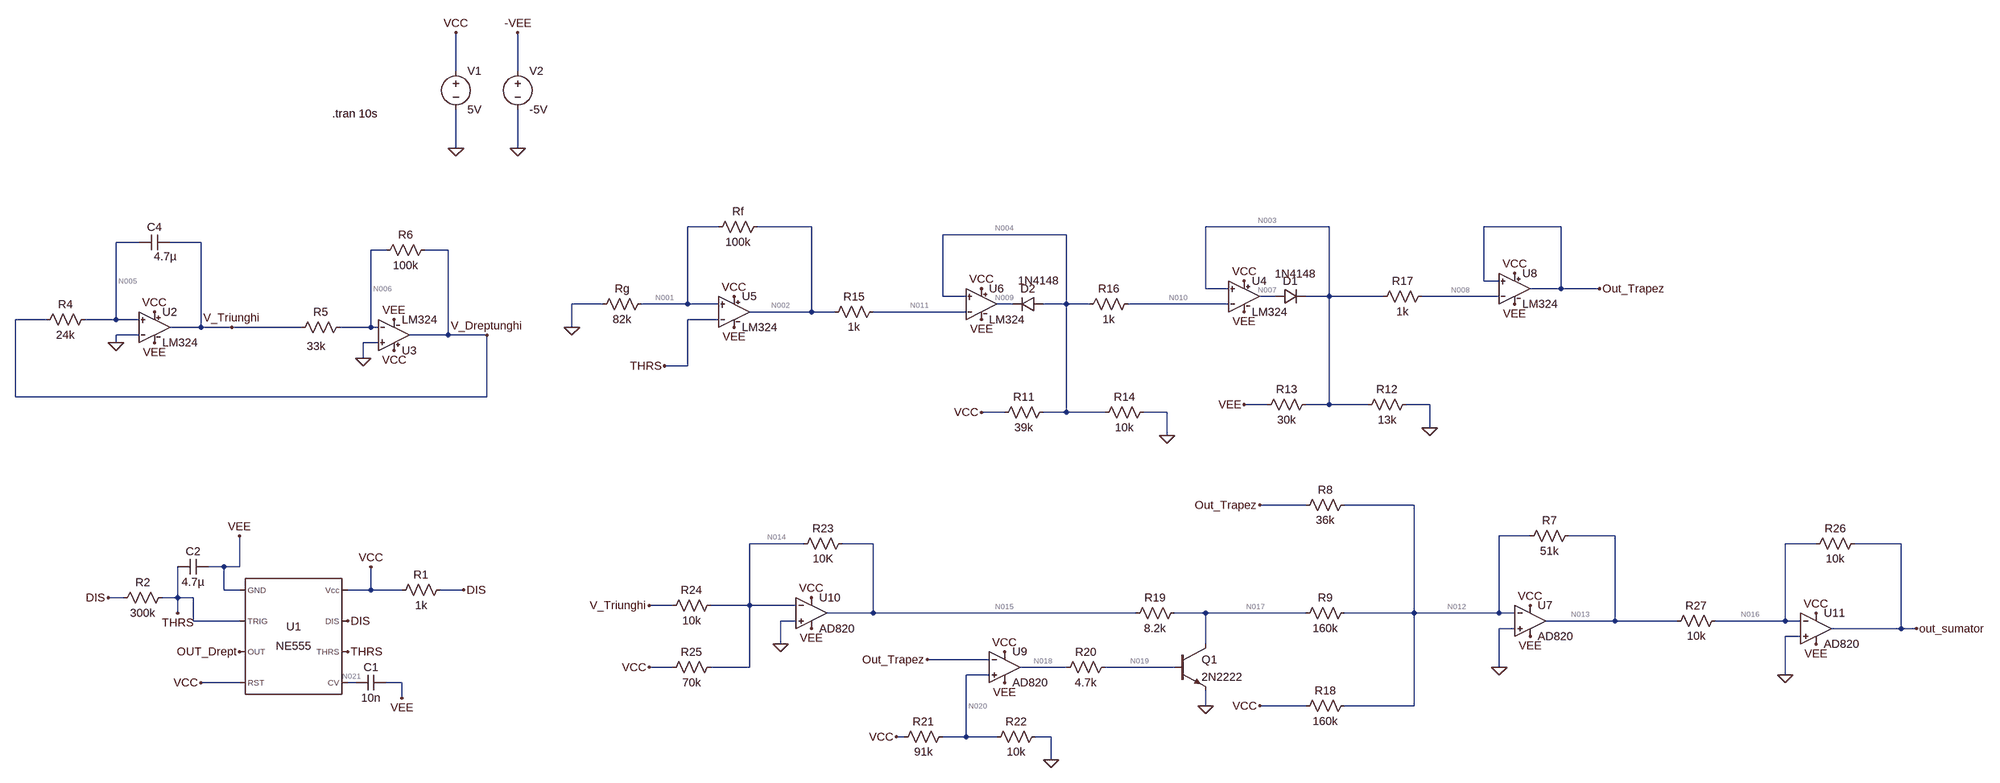
[diagram p0: schematic SCIAPROIECT.asc]
SCIAPROIECT.asc, the LTspice schematic file:
Version 4.1
SHEET 1 1268 1000
WIRE -2016 -960 -2016 -1040
WIRE -1888 -960 -1888 -1040
WIRE -2016 -800 -2016 -880
WIRE -1888 -800 -1888 -880
WIRE -1472 -624 -1536 -624
WIRE -1280 -624 -1392 -624
WIRE -208 -624 -464 -624
WIRE 272 -624 112 -624
WIRE -752 -608 -1008 -608
WIRE -2672 -592 -2720 -592
WIRE -2544 -592 -2608 -592
WIRE -2160 -576 -2192 -576
WIRE -2032 -576 -2080 -576
WIRE 112 -512 112 -624
WIRE 144 -512 112 -512
WIRE -464 -496 -464 -624
WIRE -416 -496 -464 -496
WIRE 272 -496 272 -624
WIRE 272 -496 208 -496
WIRE 352 -496 272 -496
WIRE -1008 -480 -1008 -608
WIRE -960 -480 -1008 -480
WIRE -320 -480 -352 -480
WIRE -208 -480 -208 -624
WIRE -208 -480 -256 -480
WIRE -96 -480 -208 -480
WIRE 144 -480 -16 -480
WIRE -1712 -464 -1776 -464
WIRE -1536 -464 -1536 -624
WIRE -1536 -464 -1632 -464
WIRE -1472 -464 -1536 -464
WIRE -864 -464 -896 -464
WIRE -752 -464 -752 -608
WIRE -752 -464 -800 -464
WIRE -704 -464 -752 -464
WIRE -416 -464 -624 -464
WIRE -1280 -448 -1280 -624
WIRE -1280 -448 -1408 -448
WIRE -1232 -448 -1280 -448
WIRE -960 -448 -1152 -448
WIRE -2864 -432 -2928 -432
WIRE -2720 -432 -2720 -592
WIRE -2720 -432 -2784 -432
WIRE -2672 -432 -2720 -432
WIRE -1472 -432 -1536 -432
WIRE -2544 -416 -2544 -592
WIRE -2544 -416 -2608 -416
WIRE -2480 -416 -2544 -416
WIRE -2336 -416 -2480 -416
WIRE -2192 -416 -2192 -576
WIRE -2192 -416 -2256 -416
WIRE -2176 -416 -2192 -416
WIRE -1776 -416 -1776 -464
WIRE -2672 -400 -2720 -400
WIRE -2032 -400 -2032 -576
WIRE -2032 -400 -2112 -400
WIRE -1952 -400 -2032 -400
WIRE -2720 -384 -2720 -400
WIRE -2176 -384 -2208 -384
WIRE -2208 -352 -2208 -384
WIRE -1536 -336 -1536 -432
WIRE -1536 -336 -1584 -336
WIRE -2928 -272 -2928 -432
WIRE -1952 -272 -1952 -400
WIRE -1952 -272 -2928 -272
WIRE -336 -256 -384 -256
WIRE -208 -256 -208 -480
WIRE -208 -256 -256 -256
WIRE -128 -256 -208 -256
WIRE 0 -256 -48 -256
WIRE -880 -240 -928 -240
WIRE -752 -240 -752 -464
WIRE -752 -240 -800 -240
WIRE -672 -240 -752 -240
WIRE -544 -240 -592 -240
WIRE 0 -208 0 -256
WIRE -544 -192 -544 -240
WIRE -256 -48 -352 -48
WIRE -32 -48 -176 -48
WIRE 208 16 144 16
WIRE 384 16 288 16
WIRE -1296 32 -1408 32
WIRE -1152 32 -1216 32
WIRE 800 32 736 32
WIRE 976 32 880 32
WIRE -2496 80 -2528 80
WIRE -2464 80 -2464 16
WIRE -2464 80 -2496 80
WIRE -2496 128 -2496 80
WIRE -2464 128 -2496 128
WIRE -2192 128 -2192 80
WIRE -2192 128 -2240 128
WIRE -2128 128 -2192 128
WIRE -2000 128 -2048 128
WIRE -2704 144 -2736 144
WIRE -2592 144 -2592 80
WIRE -2592 144 -2624 144
WIRE -2560 144 -2592 144
WIRE -1568 160 -1616 160
WIRE -1408 160 -1408 32
WIRE -1408 160 -1488 160
WIRE -1312 160 -1408 160
WIRE -2592 176 -2592 144
WIRE -1152 176 -1152 32
WIRE -1152 176 -1248 176
WIRE -608 176 -1152 176
WIRE -464 176 -528 176
WIRE -256 176 -464 176
WIRE -32 176 -32 -48
WIRE -32 176 -176 176
WIRE 144 176 144 16
WIRE 144 176 -32 176
WIRE 176 176 144 176
WIRE -2560 192 -2560 144
WIRE -2464 192 -2560 192
WIRE -1312 192 -1344 192
WIRE 384 192 384 16
WIRE 384 192 240 192
WIRE 512 192 384 192
WIRE 736 192 736 32
WIRE 736 192 592 192
WIRE 768 192 736 192
WIRE 176 208 144 208
WIRE 976 208 976 32
WIRE 976 208 832 208
WIRE 1008 208 976 208
WIRE 768 224 736 224
WIRE -1344 240 -1344 192
WIRE -464 240 -464 176
WIRE -912 272 -1040 272
WIRE -1568 288 -1616 288
WIRE -1408 288 -1408 160
WIRE -1408 288 -1488 288
WIRE -752 288 -848 288
WIRE -528 288 -672 288
WIRE 144 288 144 208
WIRE -912 304 -960 304
WIRE 736 304 736 224
WIRE -2464 320 -2544 320
WIRE -2224 320 -2240 320
WIRE -2128 320 -2160 320
WIRE -2128 352 -2128 320
WIRE -464 368 -464 336
WIRE -256 368 -352 368
WIRE -32 368 -32 176
WIRE -32 368 -176 368
WIRE -1088 432 -1104 432
WIRE -960 432 -960 304
WIRE -960 432 -1008 432
WIRE -896 432 -960 432
WIRE -784 432 -816 432
WIRE -784 480 -784 432
FLAG -2192 80 VCC
FLAG -2544 320 VCC
FLAG -2000 128 DIS
FLAG -2240 192 DIS
FLAG -2736 144 DIS
FLAG -2240 256 THRS
FLAG -2592 176 THRS
FLAG -2464 256 OUT_Drept
FLAG -2640 -448 VCC
FLAG -2640 -384 VEE
FLAG -2144 -368 VCC
FLAG -2720 -384 0
FLAG -2480 -416 V_Triunghi
FLAG -1952 -400 V_Dreptunghi
FLAG -2208 -352 0
FLAG -2144 -432 VEE
FLAG -1440 -480 VCC
FLAG -1440 -416 VEE
FLAG -1584 -336 THRS
FLAG -1776 -416 0
FLAG -544 -192 0
FLAG -928 -240 VCC
FLAG -928 -496 VCC
FLAG -928 -432 VEE
FLAG -2464 16 VEE
FLAG 352 -496 Out_Trapez
FLAG 0 -208 0
FLAG -384 -512 VCC
FLAG -384 -448 VEE
FLAG -384 -256 VEE
FLAG 176 -528 VCC
FLAG 176 -464 VEE
FLAG 144 288 0
FLAG 208 224 VEE
FLAG 1008 208 out_sumator
FLAG -2128 352 VEE
FLAG -464 368 0
FLAG -1040 272 Out_Trapez
FLAG -784 480 0
FLAG -880 256 VCC
FLAG -880 320 VEE
FLAG -1104 432 VCC
FLAG -1616 160 V_Triunghi
FLAG -1280 144 VCC
FLAG -1280 208 VEE
FLAG -1344 240 0
FLAG 736 304 0
FLAG 800 176 VCC
FLAG 800 240 VEE
FLAG -1616 288 VCC
FLAG 208 160 VCC
FLAG -352 368 VCC
FLAG -352 -48 Out_Trapez
FLAG -2016 -800 0
FLAG -1888 -800 0
FLAG -2016 -1040 VCC
FLAG -1888 -1040 -VEE
SYMBOL Misc\\NE555 -2352 224 R0
SYMATTR InstName U1
SYMBOL cap -2160 304 R90
WINDOW 0 0 32 VBottom 2
WINDOW 3 32 32 VTop 2
SYMATTR InstName C1
SYMATTR Value 10n
SYMBOL res -2032 112 R90
WINDOW 0 0 56 VBottom 2
WINDOW 3 32 56 VTop 2
SYMATTR InstName R1
SYMATTR Value 1k
SYMBOL res -2608 128 R90
WINDOW 0 0 56 VBottom 2
WINDOW 3 32 56 VTop 2
SYMATTR InstName R2
SYMATTR Value 300k
SYMBOL cap -2528 64 R90
WINDOW 0 0 32 VBottom 2
WINDOW 3 32 32 VTop 2
SYMATTR InstName C2
SYMATTR Value 4.7µ
SYMBOL cap -2608 -608 R90
WINDOW 0 0 32 VBottom 2
WINDOW 3 30 10 VTop 2
SYMATTR InstName C4
SYMATTR Value 4.7µ
SYMBOL res -2768 -448 R90
WINDOW 0 0 56 VBottom 2
WINDOW 3 32 56 VTop 2
SYMATTR InstName R4
SYMATTR Value 24k
SYMBOL res -2240 -432 R90
WINDOW 0 0 56 VBottom 2
WINDOW 3 40 65 VTop 2
SYMATTR InstName R5
SYMATTR Value 33k
SYMBOL res -2064 -592 R90
WINDOW 0 0 56 VBottom 2
WINDOW 3 32 56 VTop 2
SYMATTR InstName R6
SYMATTR Value 100k
SYMBOL res -1616 -480 R90
WINDOW 0 0 56 VBottom 2
WINDOW 3 32 56 VTop 2
SYMATTR InstName Rg
SYMATTR Value 82k
SYMBOL res -1376 -640 R90
WINDOW 0 0 56 VBottom 2
WINDOW 3 32 56 VTop 2
SYMATTR InstName Rf
SYMATTR Value 100k
SYMBOL res -576 -256 R90
WINDOW 0 0 56 VBottom 2
WINDOW 3 32 56 VTop 2
SYMATTR InstName R14
SYMATTR Value 10k
SYMBOL res -1136 -464 R90
WINDOW 0 0 56 VBottom 2
WINDOW 3 32 56 VTop 2
SYMATTR InstName R15
SYMATTR Value 1k
SYMBOL diode -800 -480 R90
WINDOW 0 0 32 VBottom 2
WINDOW 3 -48 10 VTop 2
SYMATTR InstName D2
SYMATTR Value 1N4148
SYMBOL res -784 -256 R90
WINDOW 0 0 56 VBottom 2
WINDOW 3 32 56 VTop 2
SYMATTR InstName R11
SYMATTR Value 39k
SYMBOL res -32 -272 R90
WINDOW 0 0 56 VBottom 2
WINDOW 3 32 56 VTop 2
SYMATTR InstName R12
SYMATTR Value 13k
SYMBOL diode -320 -464 R270
WINDOW 0 32 32 VTop 2
WINDOW 3 78 42 VBottom 2
SYMATTR InstName D1
SYMATTR Value 1N4148
SYMBOL res -240 -272 R90
WINDOW 0 0 56 VBottom 2
WINDOW 3 32 56 VTop 2
SYMATTR InstName R13
SYMATTR Value 30k
SYMBOL res -608 -480 R90
WINDOW 0 0 56 VBottom 2
WINDOW 3 32 56 VTop 2
SYMATTR InstName R16
SYMATTR Value 1k
SYMBOL res 0 -496 R90
WINDOW 0 0 56 VBottom 2
WINDOW 3 32 56 VTop 2
SYMATTR InstName R17
SYMATTR Value 1k
SYMBOL LM324 -1440 -512 R0
SYMATTR InstName U5
SYMBOL LM324 -928 -528 R0
SYMATTR InstName U6
SYMBOL LM324 -384 -544 R0
SYMATTR InstName U4
SYMBOL LM324 176 -560 R0
SYMATTR InstName U8
SYMBOL res 304 0 R90
WINDOW 0 0 56 VBottom 2
WINDOW 3 32 56 VTop 2
SYMATTR InstName R7
SYMATTR Value 51k
SYMBOL res -160 -64 R90
WINDOW 0 0 56 VBottom 2
WINDOW 3 32 56 VTop 2
SYMATTR InstName R8
SYMATTR Value 36k
SYMBOL res -160 352 R90
WINDOW 0 0 56 VBottom 2
WINDOW 3 32 56 VTop 2
SYMATTR InstName R18
SYMATTR Value 160k
SYMBOL LM324 -2640 -480 R0
SYMATTR InstName U2
SYMBOL LM324 -2144 -336 M180
SYMATTR InstName U3
SYMBOL res -656 272 R90
WINDOW 0 0 56 VBottom 2
WINDOW 3 32 56 VTop 2
SYMATTR InstName R20
SYMATTR Value 4.7k
SYMBOL res -992 416 R90
WINDOW 0 0 56 VBottom 2
WINDOW 3 32 56 VTop 2
SYMATTR InstName R21
SYMATTR Value 91k
SYMBOL res -800 416 R90
WINDOW 0 0 56 VBottom 2
WINDOW 3 32 56 VTop 2
SYMATTR InstName R22
SYMATTR Value 10k
SYMBOL OpAmps\\AD820 208 128 R0
SYMATTR InstName U7
SYMBOL npn -528 240 R0
SYMATTR InstName Q1
SYMATTR Value 2N2222
SYMBOL res -160 160 R90
WINDOW 0 0 56 VBottom 2
WINDOW 3 32 56 VTop 2
SYMATTR InstName R9
SYMATTR Value 160k
SYMBOL res -512 160 R90
WINDOW 0 0 56 VBottom 2
WINDOW 3 32 56 VTop 2
SYMATTR InstName R19
SYMATTR Value 8.2k
SYMBOL OpAmps\\AD820 -1280 112 R0
SYMATTR InstName U10
SYMBOL res -1200 16 R90
WINDOW 0 0 56 VBottom 2
WINDOW 3 32 56 VTop 2
SYMATTR InstName R23
SYMATTR Value 10K
SYMBOL res -1472 144 R90
WINDOW 0 0 56 VBottom 2
WINDOW 3 32 56 VTop 2
SYMATTR InstName R24
SYMATTR Value 10k
SYMBOL res -1472 272 R90
WINDOW 0 0 56 VBottom 2
WINDOW 3 32 56 VTop 2
SYMATTR InstName R25
SYMATTR Value 70k
SYMBOL res 896 16 R90
WINDOW 0 0 56 VBottom 2
WINDOW 3 32 56 VTop 2
SYMATTR InstName R26
SYMATTR Value 10k
SYMBOL OpAmps\\AD820 800 144 R0
SYMATTR InstName U11
SYMBOL res 608 176 R90
WINDOW 0 0 56 VBottom 2
WINDOW 3 32 56 VTop 2
SYMATTR InstName R27
SYMATTR Value 10k
SYMBOL OpAmps\\AD820 -880 224 R0
SYMATTR InstName U9
SYMBOL voltage -2016 -976 R0
SYMATTR InstName V1
SYMATTR Value 5V
SYMBOL voltage -1888 -976 R0
SYMATTR InstName V2
SYMATTR Value -5V
TEXT -2272 -872 Left 2 !.tran 10s

The netlist it stands for:
* SCIAPROIECT.asc
X§U1 VEE THRS OUT_Drept VCC N021 THRS DIS VCC NE555  ; pins GND TRIG OUT RST CV THRS DIS Vcc
C1 VEE N021 10n
R1 DIS VCC 1k
R2 THRS DIS 300k
C2 VEE THRS 4.7µ
C4 V_Triunghi N005 4.7µ
R4 N005 V_Dreptunghi 24k
R5 N006 V_Triunghi 33k
R6 V_Dreptunghi N006 100k
Rg N001 0 82k
Rf N002 N001 100k
R14 0 N004 10k
R15 N011 N002 1k
D2 N004 N009 1N4148
R11 N004 VCC 39k
R12 0 N003 13k
D1 N007 N003 1N4148
R13 N003 VEE 30k
R16 N010 N004 1k
R17 N008 N003 1k
X§U5 THRS N001 VCC VEE N002 LM324  ; pins In+ In- V+ V- OUT
X§U6 N011 N004 VCC VEE N009 LM324  ; pins In+ In- V+ V- OUT
X§U4 N010 N003 VCC VEE N007 LM324  ; pins In+ In- V+ V- OUT
X§U8 N008 Out_Trapez VCC VEE Out_Trapez LM324  ; pins In+ In- V+ V- OUT
R7 N013 N012 51k
R8 N012 Out_Trapez 36k
R18 N012 VCC 160k
X§U2 0 N005 VCC VEE V_Triunghi LM324  ; pins In+ In- V+ V- OUT
X§U3 N006 0 VCC VEE V_Dreptunghi LM324  ; pins In+ In- V+ V- OUT
R20 N019 N018 4.7k
R21 N020 VCC 91k
R22 0 N020 10k
X§U7 0 N012 VCC VEE N013 AD820  ; pins In+ In- V+ V- OUT
Q1 N017 N019 0 0 2N2222
R9 N012 N017 160k
R19 N017 N015 8.2k
X§U10 0 N014 VCC VEE N015 AD820  ; pins In+ In- V+ V- OUT
R23 N015 N014 10K
R24 N014 V_Triunghi 10k
R25 N014 VCC 70k
R26 out_sumator N016 10k
X§U11 0 N016 VCC VEE out_sumator AD820  ; pins In+ In- V+ V- OUT
R27 N016 N013 10k
X§U9 N020 Out_Trapez VCC VEE N018 AD820  ; pins In+ In- V+ V- OUT
V1 VCC 0 5V
V2 -VEE 0 -5V
.model D D
.lib standard.dio
.model NPN NPN
.model PNP PNP
.lib standard.bjt
.tran 10s
.lib NE555.sub
.lib LM324.lib
.backanno
.end

* Results of the author's LTspice run, read from the files saved beside the schematic
* Operating Point, zero values left out:
*   V(-vee) = -5 V
*   V(dis) = 3.515 V
*   V(n001) = 2.752 V
*   V(n002) = 3.488 V
*   V(n003) = 3.03 V
*   V(n004) = 2.271 V
*   V(n005) = 3.31 V
*   V(n006) = 3.546 V
*   V(n007) = 3.544 V
*   V(n008) = 3.031 V
*   V(n009) = 3.459 V
*   V(n010) = 2.346 V
*   V(n011) = 3.488 V
*   V(n012) = 3.294 V
*   V(n013) = 3.512 V
*   V(n014) = 3.641 V
*   V(n015) = 3.501 V
*   V(n016) = 3.519 V
*   V(n017) = 12.46 mV
*   V(n018) = 3.497 V
*   V(n019) = 687.9 mV
*   V(n020) = 495 mV
*   V(n021) = 4.502 V
*   V(out_drept) = 3.506 V
*   V(out_sumator) = 3.527 V
*   V(out_trapez) = 3.495 V
*   V(thrs) = 4.912 V
*   V(v_dreptunghi) = 3.418 V
*   V(v_triunghi) = 3.588 V
*   V(vcc) = 5 V
*   V(vee) = 3.506 V
*   I(C1) = -5.607 pA
*   I(C2) = 4.661 µA
*   I(C4) = -4.518 µA
*   I(D1) = 215.8 µA
*   I(D2) = -2.521 nA
*   I(R1) = -1.485 mA
*   I(R11) = -69.97 µA
*   I(R12) = -233.1 µA
*   I(R13) = -15.88 µA
*   I(R14) = -227.1 µA
*   I(R16) = 74.28 µA
*   I(R17) = 1.293 µA
*   I(R18) = -10.66 µA
*   I(R19) = -425.4 µA
*   I(R2) = 4.658 µA
*   I(R20) = -597.6 µA
*   I(R21) = -49.5 µA
*   I(R22) = -49.5 µA
*   I(R23) = -14.05 µA
*   I(R24) = 5.359 µA
*   I(R25) = -19.41 µA
*   I(R26) = 726.1 nA
*   I(R27) = 726.1 nA
*   I(R4) = -4.518 µA
*   I(R5) = -1.272 µA
*   I(R6) = -1.272 µA
*   I(R7) = 4.273 µA
*   I(R8) = -5.575 µA
*   I(R9) = 20.51 µA
*   I(Rf) = 7.365 µA
*   I(Rg) = 33.56 µA
*   I(V1) = -2.117 mA
*   Ib(Q1) = 597.6 µA
*   Ic(Q1) = 445.9 µA
*   Ie(Q1) = -1.044 mA
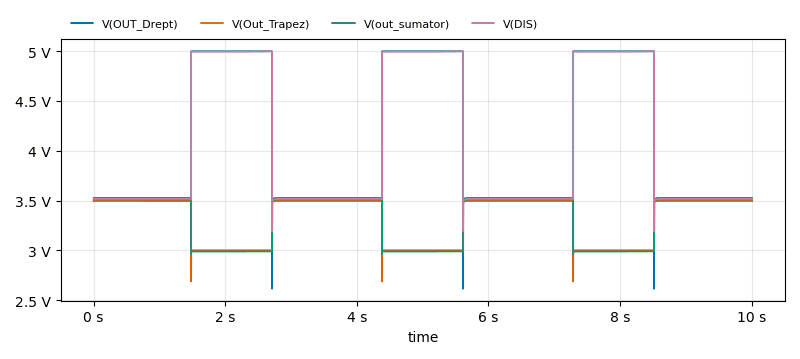
[diagram p1: Transient Analysis of SCIAPROIECT.asc, plotted from the saved traces]
* Transient Analysis, 1 run:
*   V(OUT_Drept): min 2.612 V, max 5 V, average 4.057 V, rms 4.121 V, last 3.506 V
*   V(Out_Trapez): min 2.686 V, max 3.495 V, average 3.312 V, rms 3.321 V, last 3.495 V
*   V(out_sumator): min 2.966 V, max 3.527 V, average 3.327 V, rms 3.337 V, last 3.527 V
*   V(DIS): min 3.193 V, max 4.998 V, average 4.061 V, rms 4.124 V, last 3.515 V